# Altium schematic sheet Sheet1.schdoc
size A
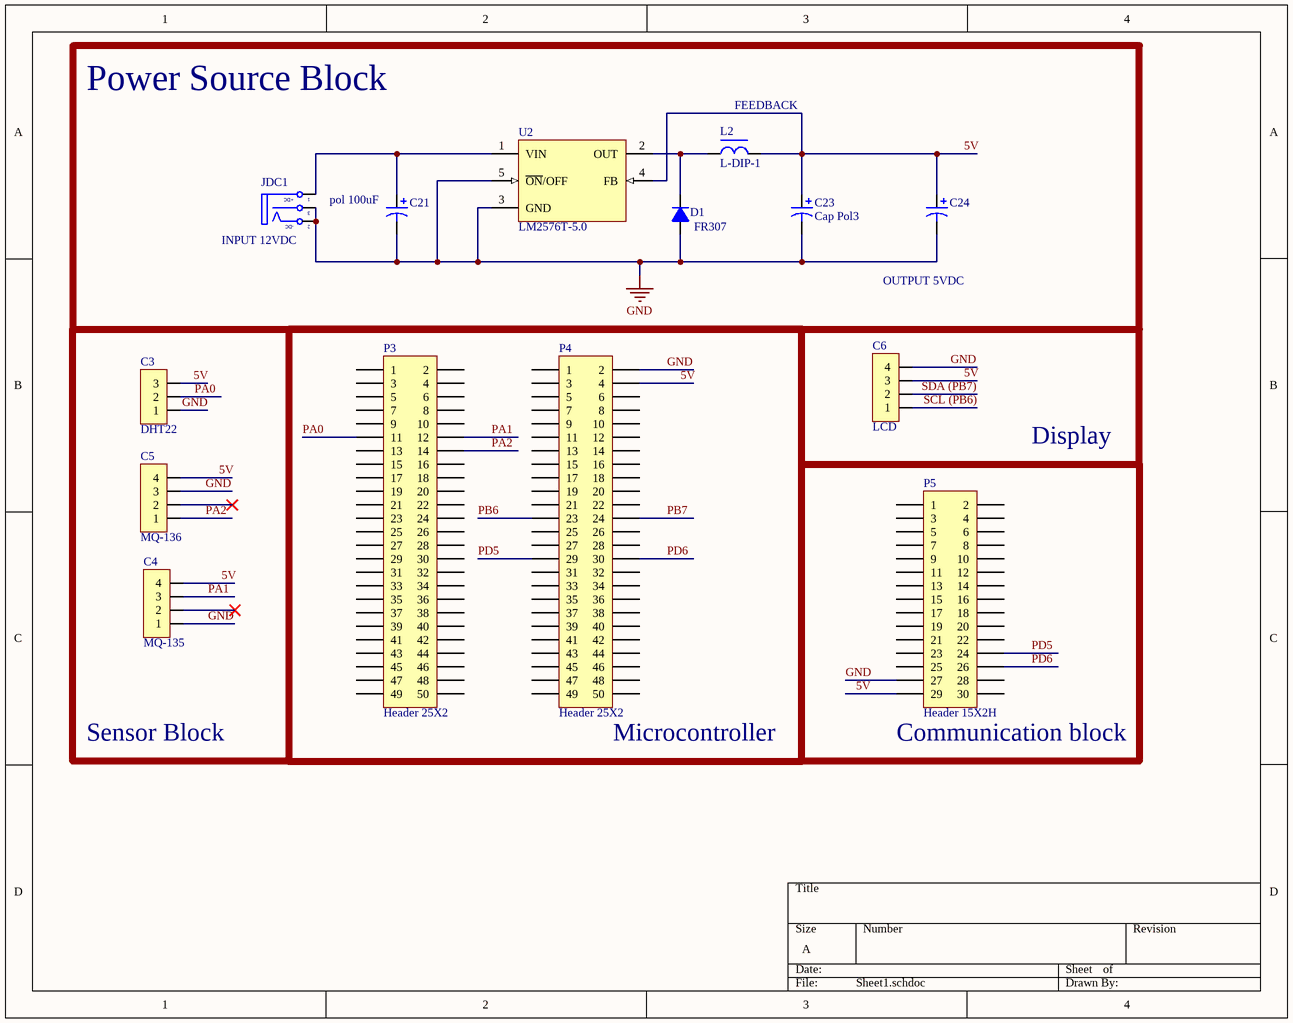
[diagram p0: Sheet1.schdoc]

## Parts
C3  DHT22  [JP3-C1T]
C4  MQ-135  [JP4-C1T]
C5  MQ-136  [JP4-C1T]
C6  LCD  [JP4-C1T]
C21  pol 100uF  [C10mm]
C23  Cap Pol3  [CP2/5]
C24  (no value)  [C10mm]
D1  FR307  [D2A]
JDC1  (no value)  [DC-IN]
L2  L-DIP-1  [L-DIP-M-5.3]
P3  Header 25X2  [HDR2X25]
P4  Header 25X2  [HDR2X25]
P5  Header 15X2H  [HDR2X15H]
U2  LM2576T-5.0  [LM2576t]

## Blocks framed on the sheet
Power Source Block: C21 C23 C24 D1 JDC1 L2 U2
Microcontroller: P3 P4

## Nets
GND: C3.1 C4.1 C5.3 C6.4 C21.2 C23.2 C24.2 D1.1(A) JDC1.2(TN) JDC1.3(S) P4.2 P5.27 U2.3(GND) U2.5(~{ON}/OFF)
5V: C3.3 C4.4 C5.4 C6.3 C23.1 C24.1 L2.2 P4.4 P5.29 U2.4(FB)
PA0: C3.2 P3.11
PA1: C4.3 P3.12
PA2: C5.1 P3.14
PB6: P4.23
PB7: P4.24
PD5: P4.29 P5.24
PD6: P4.30 P5.26
SCL (PB6): C6.1
SDA (PB7): C6.2
NetC21_1: C21.1 JDC1.1(T) U2.1(VIN)
NetD1_2: D1.2(K) L2.1 U2.2(OUT)

Not connected (* = marked no-connect by the designer): C4 2*; C5 2*; P3 1 2 3 4 5 6 7 8 9 10 13 15 16 17 18 19 20 21 22 23 24 25 26 27 28 29 30 31 32 33 34 35 36 37 38 39 40 41 42 43 44 45 46 47 48 49 50; P4 1 3 5 6 7 8 9 10 11 12 13 14 15 16 17 18 19 20 21 22 25 26 27 28 31 32 33 34 35 36 37 38 39 40 41 42 43 44 45 46 47 48 49 50; P5 1 2 3 4 5 6 7 8 9 10 11 12 13 14 15 16 17 18 19 20 21 22 23 25 28 30

## Notes on the sheet
- (near L2) FEEDBACK
- (near JDC1) INPUT 12VDC
- OUTPUT 5VDC
- Display
- Sensor Block
- (near P5) Communication block
- (in symbol DCIN) +DC; -DC

## Library data of the parts
C3 = JP3: WR-PHD 2.54 mm Angled Socket Header; Manufacturer: W¨¹rth Elektronik eiSos GmbH; partNo: 613003143121; ComponentLink1 Description: Manufacturer; ComponentLink2 Description: Datasheet; NoPins: 03; Created Date: 29 March 2013; ComponentLink1URL: http://www.we-online.com; ComponentLink2URL: http://katalog.we-online.de/em/datasheet/6130xx143121.pdf; Created by: Karrer Zheng
C4-C6 = JP4: WR-PHD 2.54 mm Angled Socket Header; Manufacturer: W¨¹rth Elektronik eiSos GmbH; partNo: 613004143121; ComponentLink1 Description: Manufacturer; ComponentLink2 Description: Datasheet; NoPins: 04; Created Date: 29 March 2013; ComponentLink1URL: http://www.we-online.com; ComponentLink2URL: http://katalog.we-online.de/em/datasheet/6130xx143121.pdf; Created by: Karrer Zheng
C21 C24 = Cap Pol 12mm: Polarized Capacitor (Axial); Published: 8-Jun-2000; LatestRevisionDate: 17-Jul-2002; LatestRevisionNote: Re-released for DXP Platform.; PackageReference: POLAR0.8; Publisher: Altium Limited
C23 = Cap Pol3: Polarized Capacitor (Surface Mount); VALUE: C?; LatestRevisionDate: 17-Jul-2002; LatestRevisionNote: Re-released for DXP Platform.; PackageReference: C0805; Publisher: Altium Limited
D1 = D1A: Diode 1A; Value: 1N4007
JDC1 = DCIN: Jac DC input; Value: Jac DC
L2 = L-DIP-1: Inductor; Value: 150 mH
P3 P4 = Header 25X2: Header, 25-Pin, Dual row; LatestRevisionDate: 17-Jul-2002; LatestRevisionNote: Re-released for DXP Platform.; Publisher: Altium Limited
P5 = Header 15X2H: Header, 15-Pin, Dual row, Right Angle; LatestRevisionDate: 17-Jul-2002; LatestRevisionNote: Re-released for DXP Platform.; Publisher: Altium Limited
U2 = LM2576T-5.0: SIMPLE SWITCHER; 3A Step-Down Voltage Regulator; Manufacturer: National Semiconductor; PackageTopMarking: NSUZXYTT*LM2576T*-5.0 P+; PowerWise: N; FirstPublished: 4-Dec-2008; DatasheetVersion: Aug-2004; PackageVersion: revJ, Jan-1992; PackageReference: T05A; Publisher: Altium Limited; PackageDescription: TO-220, Molded, 5 Lead, Straight; CompType: Switcher; PartNumber: LM2576T-5.0; RoHS: O; PinCount: 5; DigiKeyPartNumber: LM2576T-5.0-ND; Code_JEDEC: TO-220-AB; ComponentLink1Description: LM2576 Datasheet; ComponentLink1URL: http://www.national.com/ds/LM/LM2576.pdf; ComponentLink2Description: LM2576 Web Page; ComponentLink2URL: http://www.national.com/pf/LM/LM2576.html; ComponentLink3Description: T05A Package Page; ComponentLink3URL: http://www.national.com/packaging/folders/t05a.html